# EAGLE schematic PacBot Official Schematic 2018-2019 (EAGLE 9.2.0)
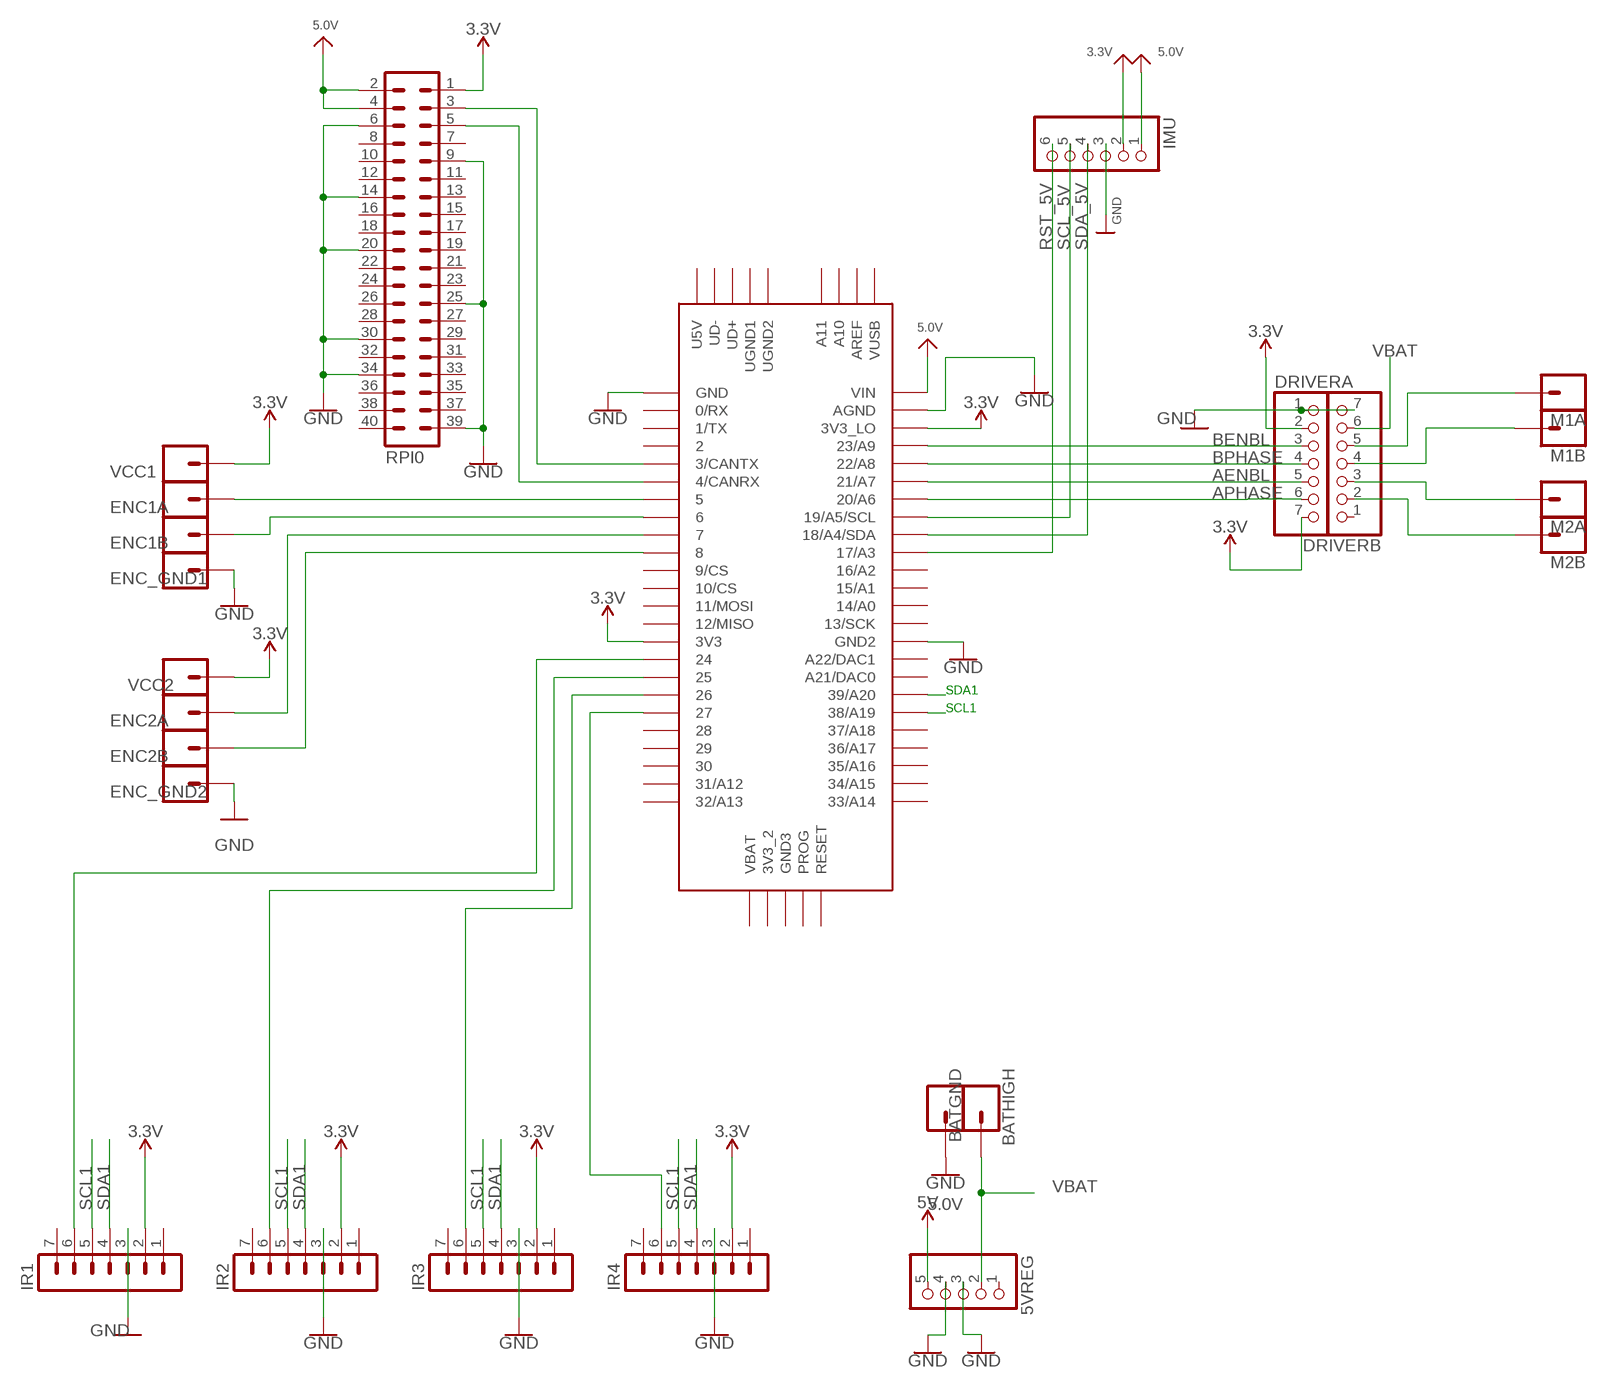
[diagram p0: schematic, sheet 1]

## Parts
5VREG  PINHD-1X5  [1X05]
BATGND  CONN_01  [1X01]
BATHIGH  CONN_01  [1X01]
DRIVERA  PINHD-1X7  [1X07]
DRIVERB  PINHD-1X7  [1X07]
ENC1A  CONN_01  [1X01]
ENC1B  CONN_01  [1X01]
ENC2A  CONN_01  [1X01]
ENC2B  CONN_01  [1X01]
ENC_GND1  CONN_01  [1X01]
ENC_GND2  CONN_01  [1X01]
IMU  HEADER-1X676MIL  [1X06_ROUND_76]
IR1  MA07-1  [MA07-1]
IR2  MA07-1  [MA07-1]
IR3  MA07-1  [MA07-1]
IR4  MA07-1  [MA07-1]
M1A  CONN_01  [1X01]
M1B  CONN_01  [1X01]
M2A  CONN_01  [1X01]
M2B  CONN_01  [1X01]
RPI0  MA20-2  [MA20-2]
U$1  TEENSY_3.5/3.6  [TEENSY_3.5/3.6]
VCC1  CONN_01  [1X01]
VCC2  CONN_01  [1X01]

## Nets
3.3V: DRIVERA.2 DRIVERA.7 IMU.2 IR1.2 IR2.2 IR3.2 IR4.2 RPI0.1 U$1.3V3 U$1.3V3_LO VCC1.1 VCC2.1
5.0V: 5VREG.5 IMU.1 RPI0.2 RPI0.4 U$1.VIN ; supply symbol labelled 5V
AENBL: DRIVERA.5 U$1.21/A7
APHASE: DRIVERA.6 U$1.20/A6
BENBL: DRIVERA.3 U$1.23/A9
BPHASE: DRIVERA.4 U$1.22/A8
GND: 5VREG.3 5VREG.4 BATGND.1 DRIVERA.1 DRIVERB.7 ENC_GND1.1 ENC_GND2.1 IMU.3 IR1.3 IR2.3 IR3.3 IR4.3 RPI0.6 RPI0.9 RPI0.14 RPI0.20 RPI0.25 RPI0.30 RPI0.34 RPI0.39 U$1.AGND U$1.GND U$1.GND2
N$1: ENC1A.1 U$1.5
N$2: IR2.6 U$1.25
N$3: RPI0.3 U$1.3/CANTX
N$4: IR3.6 U$1.26
N$5: ENC1B.1 U$1.6
N$6: RPI0.5 U$1.4/CANRX
N$7: IR4.6 U$1.27
N$8: DRIVERB.5 M1A.1
N$9: DRIVERB.4 M1B.1
N$10: DRIVERB.3 M2A.1
N$11: DRIVERB.2 M2B.1
N$12: ENC2A.1 U$1.7
N$13: ENC2B.1 U$1.8
N$23: IR1.6 U$1.24
RST_5V: IMU.6 U$1.17/A3
SCL1: IR1.5 IR2.5 IR3.5 IR4.5 U$1.38/A19
SCL_5V: IMU.5 U$1.19/A5/SCL
SDA1: IR1.4 IR2.4 IR3.4 IR4.4 U$1.39/A20
SDA_5V: IMU.4 U$1.18/A4/SDA
VBAT: 5VREG.2 BATHIGH.1 DRIVERB.6
Unconnected: 5VREG.1 DRIVERB.1 IR1.1 IR1.7 IR2.1 IR2.7 IR3.1 IR3.7 IR4.1 IR4.7 RPI0.7 RPI0.8 RPI0.10 RPI0.11 RPI0.12 RPI0.13 RPI0.15 RPI0.16 RPI0.17 RPI0.18 RPI0.19 RPI0.21 RPI0.22 RPI0.23 RPI0.24 RPI0.26 RPI0.27 RPI0.28 RPI0.29 RPI0.31 RPI0.32 RPI0.33 RPI0.35 RPI0.36 RPI0.37 RPI0.38 RPI0.40 U$1.0/RX U$1.1/TX U$1.2 U$1.3V3_2 U$1.9/CS U$1.10/CS U$1.11/MOSI U$1.12/MISO U$1.13/SCK U$1.14/A0 U$1.15/A1 U$1.16/A2 U$1.21/DAC0(A21/DAC0) U$1.28 U$1.29 U$1.30 U$1.31/A12 U$1.32/A13 U$1.33/A14 U$1.34/A15 U$1.35/A16 U$1.36/A17 U$1.37/A18 U$1.A10 U$1.A11 U$1.A22/DAC1 U$1.AREF U$1.GND3 U$1.PROG U$1.RESET U$1.U5V U$1.UD+ U$1.UD- U$1.UGND1 U$1.UGND2 U$1.VBAT U$1.VUSB

## Library data of the parts
5VREG = pinhead:PINHD-1X5: PIN HEADER
BATGND BATHIGH ENC1A ENC1B ENC2A ENC2B ENC_GND1 ENC_GND2 M1A M1B M2A M2B VCC1 VCC2 = SparkFun-Connectors:CONN_01: Single connection point. Often used as Generic Header-pin footprint for 0.1 inch spaced/style header connections On any of the 0.1 inch spaced packages, you can populate with these: Break Away Headers - Straight <https://www.sparkfun.com/products/116> (PRT-00116) Break Away Male Headers - Right Angle <https://www.sparkfun.com/products/553> (PRT-00553) Female Headers <https://www.sparkfun.com/products/115> (PRT-00115) Break Away Headers - Machine Pin <https://www.sparkfun.com/products/117> (PRT-00117) Break Away Female Headers - Swiss Machine Pin <https://www.sparkfun.com/products/743> (PRT-00743) This device is also useful as a general connection point to wire up your design to another part of your project. Our various solder wires solder well into these plated through hole pads. Hook-Up Wire - Assortment (Stranded, 22 AWG) <https://www.sparkfun.com/products/11375> (PRT-11375) Hook-Up Wire - Assortment (Solid Core, 22 AWG) <https://www.sparkfun.com/products/11367> (PRT-11367) View the entire wire category on our website here <https://www.sparkfun.com/categories/141> Special notes: SMTSO-256-ET is a "flush mount" nut for a 4-40 screw. We mostly use this on specialty testbeds; it is a nice way to connect hardware to your PCB at an adjustable hieght. Also note, the SNAP packages are for using a snappable style connector. We sell a baggie of snaps and they are also used on two LilyPad designs: Snap Assortment - 30 pack (male and female) <https://www.sparkfun.com/products/11347> (DEV-11347) LilyPad Arduino SimpleSnap <https://www.sparkfun.com/products/10941> (DEV-10941) LilyPad SimpleSnap Protoboard <https://www.sparkfun.com/products/10940> (DEV-10940)
DRIVERA DRIVERB = pinhead:PINHD-1X7: PIN HEADER
IMU = microbuilder:HEADER-1X6: PIN HEADER
IR1-IR4 = con-lstb:MA07-1: PIN HEADER; OC_FARNELL: unknown; OC_NEWARK: unknown
RPI0 = con-lstb:MA20-2: PIN HEADER; OC_FARNELL: unknown; OC_NEWARK: unknown
U$1 = Teensy356:TEENSY_3.5/3.6